# EAGLE design mini_Quad_v00 (EAGLE 9.0.1)
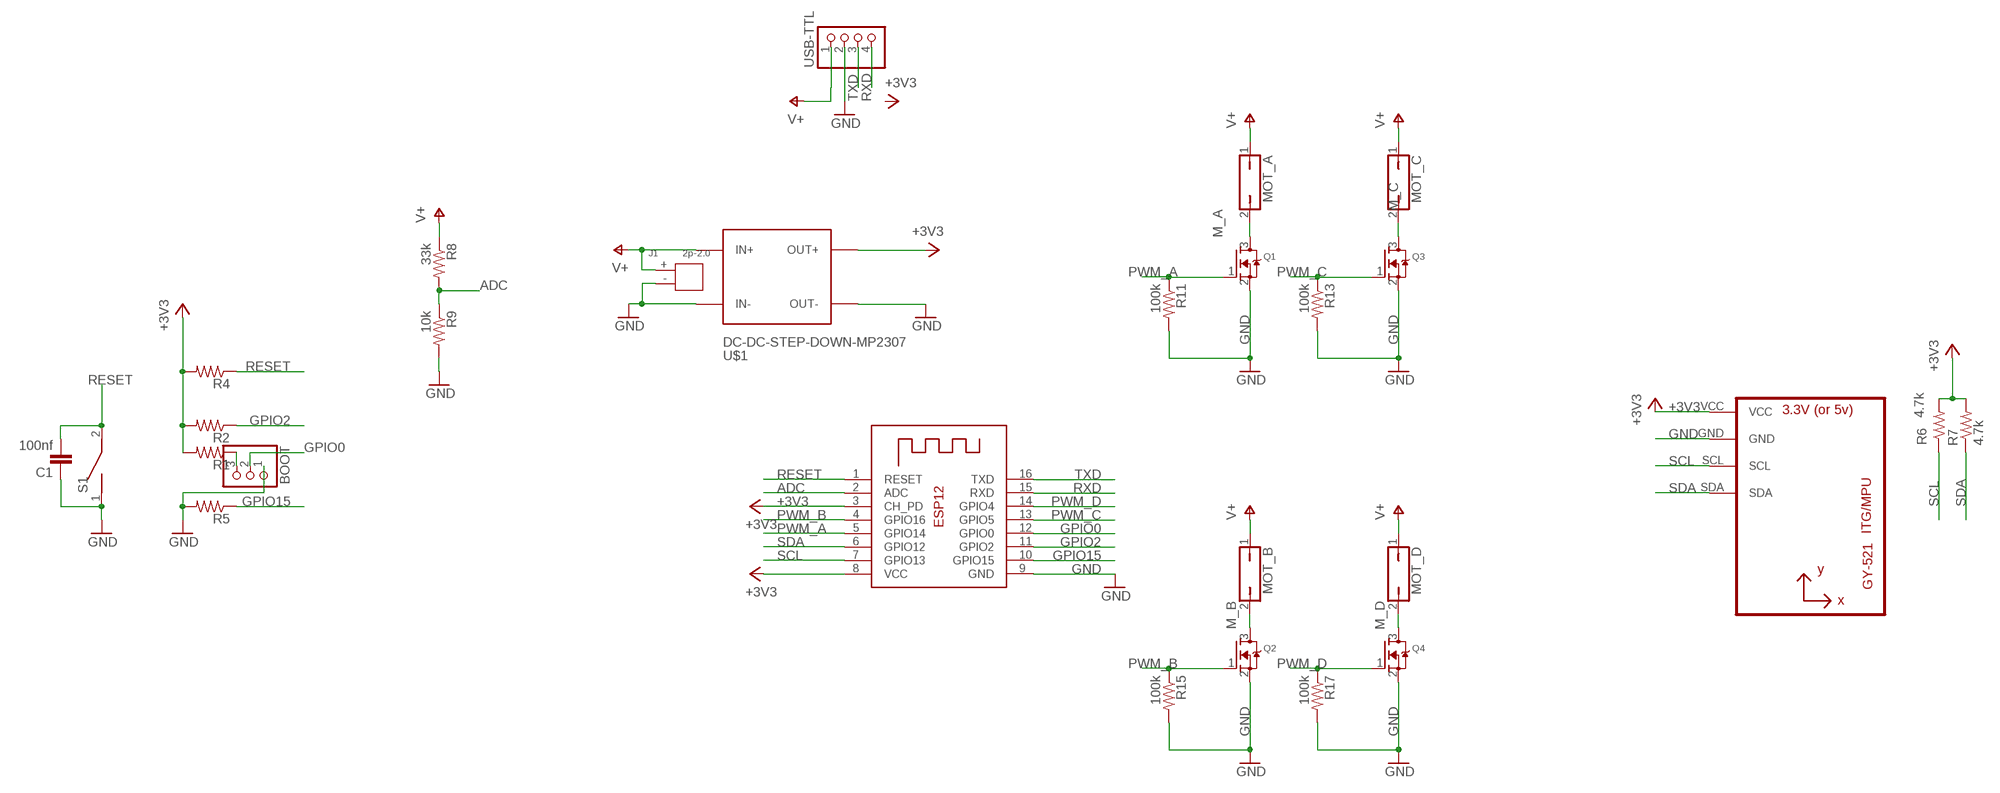
[diagram p0: schematic, sheet 1]

## Parts
BOOT  PINHD-1X3  [1X03]
C1  100nf  C-EU050-024X044  [C050-024X044]
J1  2p-2.0  DIP-JST-2P-2.0  [H2-2.0-6X4.5MM]
MOT_A  JP1Q  [JP1]
MOT_B  JP1Q  [JP1]
MOT_C  JP1Q  [JP1]
MOT_D  JP1Q  [JP1]
Q1  MOSFET-NTO252  [TO252]
Q2  MOSFET-NTO252  [TO252]
Q3  MOSFET-NTO252  [TO252]
Q4  MOSFET-NTO252  [TO252]
R1  R-US_0204/5  [0204/5]
R2  R-US_0204/5  [0204/5]
R4  R-US_0204/7  [0204/7]
R5  R-US_0204/5  [0204/5]
R6  4.7k  R-US_0204/5  [0204/5]
R7  4.7k  R-US_0204/7  [0204/7]
R8  33k  R-US_0207/10  [0207/10]
R9  10k  R-US_0204/7  [0204/7]
R11  100k  R-US_0204/5  [0204/5]
R13  100k  R-US_0204/5  [0204/5]
R15  100k  R-US_0204/5  [0204/5]
R17  100k  R-US_0204/5  [0204/5]
S1  DS01  [DS-01]
U1  GY-521MPU6050  [GY-521]
U$1  DC-DC-STEP-DOWN-MP2307  [DC-DC-STEP-DOWN-MP2307]
USB-TTL  PINHD-1X4  [1X04]
X1  ESP-12  [ESP-12]

## Nets
+3V3: R1.2 R2.2 R4.2 R6.2 R7.2 U1.VCC U$1.OUT+ X1.3(CH_PD) X1.8(VCC)
ADC: R8.2 R9.1 X1.2(ADC)
GND: BOOT.1 C1.1 J1.- Q1.2(S) Q2.2(S) Q3.2(S) Q4.2(S) R5.2 R9.2 R11.2 R13.2 R15.2 R17.2 S1.1 U1.GND U$1.IN- U$1.OUT- USB-TTL.2 X1.9(GND)
GPIO0: BOOT.2 X1.12(GPIO0)
GPIO2: R2.1 X1.11(GPIO2)
GPIO15: R5.1 X1.10(GPIO15)
M_A: MOT_A.2 Q1.3(D)
M_B: MOT_B.2 Q2.3(D)
M_C: MOT_C.2 Q3.3(D)
M_D: MOT_D.2 Q4.3(D)
N$1: BOOT.3 R1.1
PWM_A: Q1.1(G) R11.1 X1.5(GPIO14)
PWM_B: Q2.1(G) R15.1 X1.4(GPIO16)
PWM_C: Q3.1(G) R13.1 X1.13(GPIO5)
PWM_D: Q4.1(G) R17.1 X1.14(GPIO4)
RESET: C1.2 R4.1 S1.2 X1.1(RESET)
RXD: USB-TTL.4 X1.15(RXD)
SCL: R6.1 U1.SCL X1.7(GPIO13)
SDA: R7.1 U1.SDA X1.6(GPIO12)
TXD: USB-TTL.3 X1.16(TXD)
V+: J1.+ MOT_A.1 MOT_B.1 MOT_C.1 MOT_D.1 R8.1 U$1.IN+ USB-TTL.1

## Library data of the parts
BOOT = mini_Quad_v00:PINHD-1X3: PIN HEADER
C1 = mini_Quad_v00:C-EU: CAPACITOR, European symbol; SPICEPREFIX: C
J1 = mini_Quad_v00:DIP-JST-2P-2.0: 320110049
MOT_A MOT_B MOT_C MOT_D = mini_Quad_v00:JP1Q: JUMPER
Q1-Q4 = mini_Quad_v00:MOSFET-N: N-Channel Mosfet 2N7002E - 60V 260mA SOT23 [Digikey: 2N7002ET1GOSTR-ND] - REEL BSH103 - 30V 850mA SOT23 [Digikey: 568-5013-1-ND]
R1 R2 R4-R9 R11 R13 R15 R17 = mini_Quad_v00:R-US_: RESISTOR, American symbol; SPICEPREFIX: R
S1 = mini_Quad_v00:DS01: DIL/CODE SWITCH; OC_FARNELL: unknown; OC_NEWARK: unknown
U1 = mini_Quad_v00:GY-521
U$1 = mini_Quad_v00:DC-DC-STEP-DOWN-MP2307: DC/DC Step-Down Regulator based on MP2307DN chip MP2307 datasheet available here: https://cdn-shop.adafruit.com/datasheets/MP2307_r1.9.pdf Click here to find device on ebay.com <http://www.ebay.com/sch/dc+dc+3a+mini+converter>
USB-TTL = pinhead:PINHD-1X4: PIN HEADER
X1 = mini_Quad_v00:ESP-12

## Board
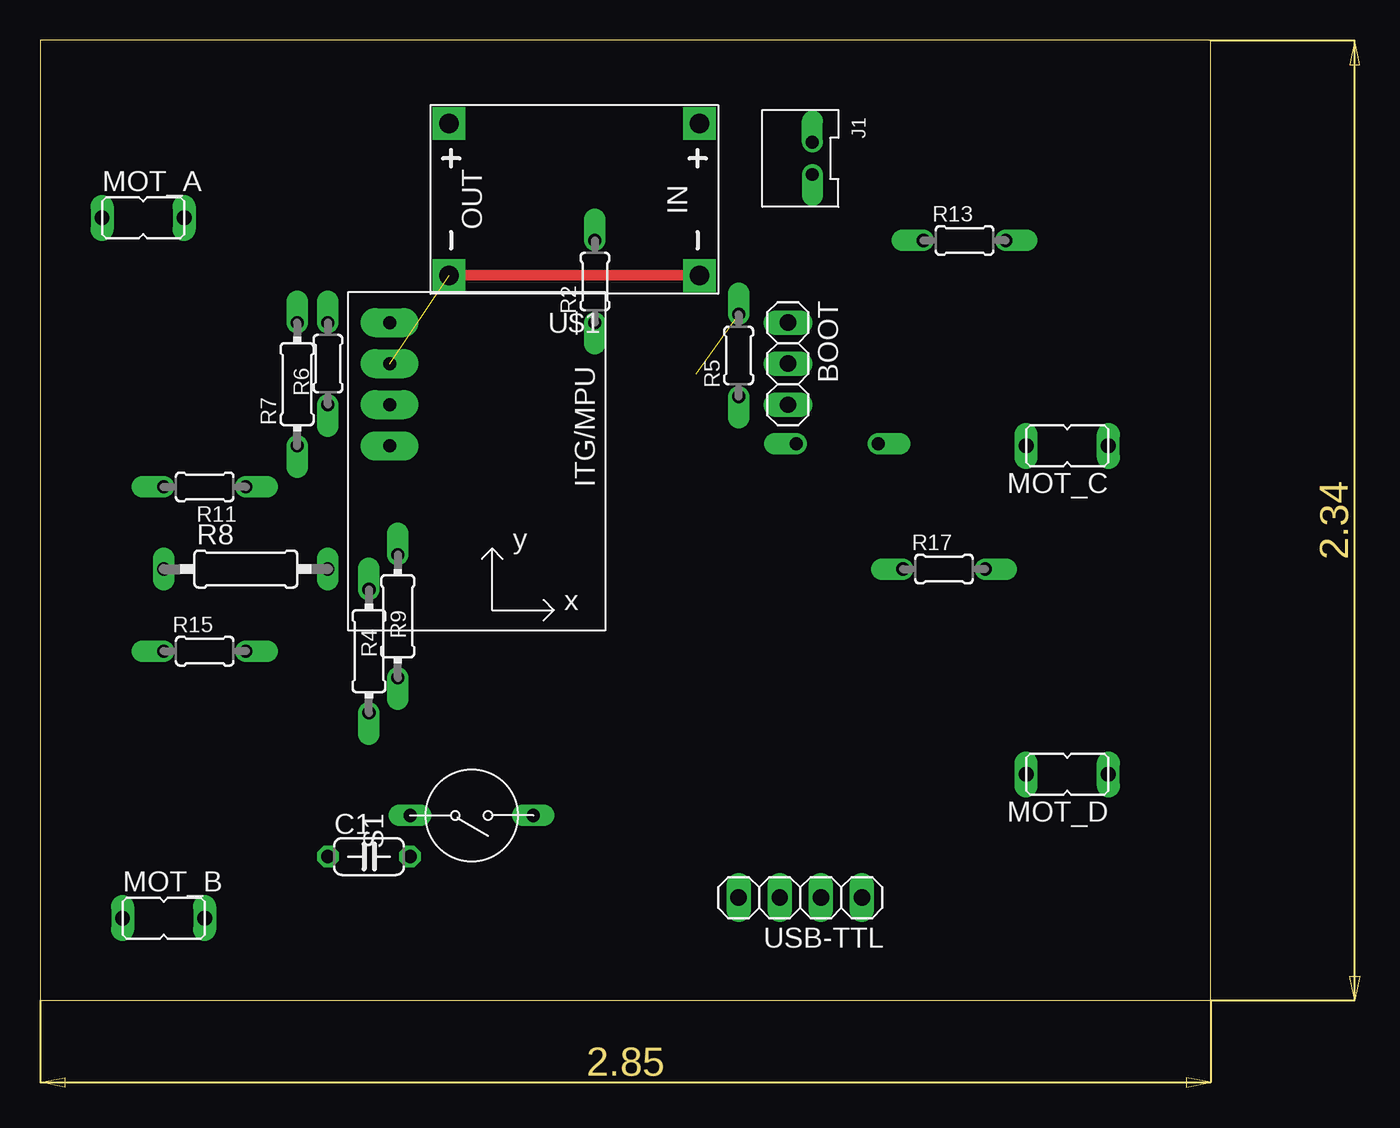
[diagram p1: board, top side]
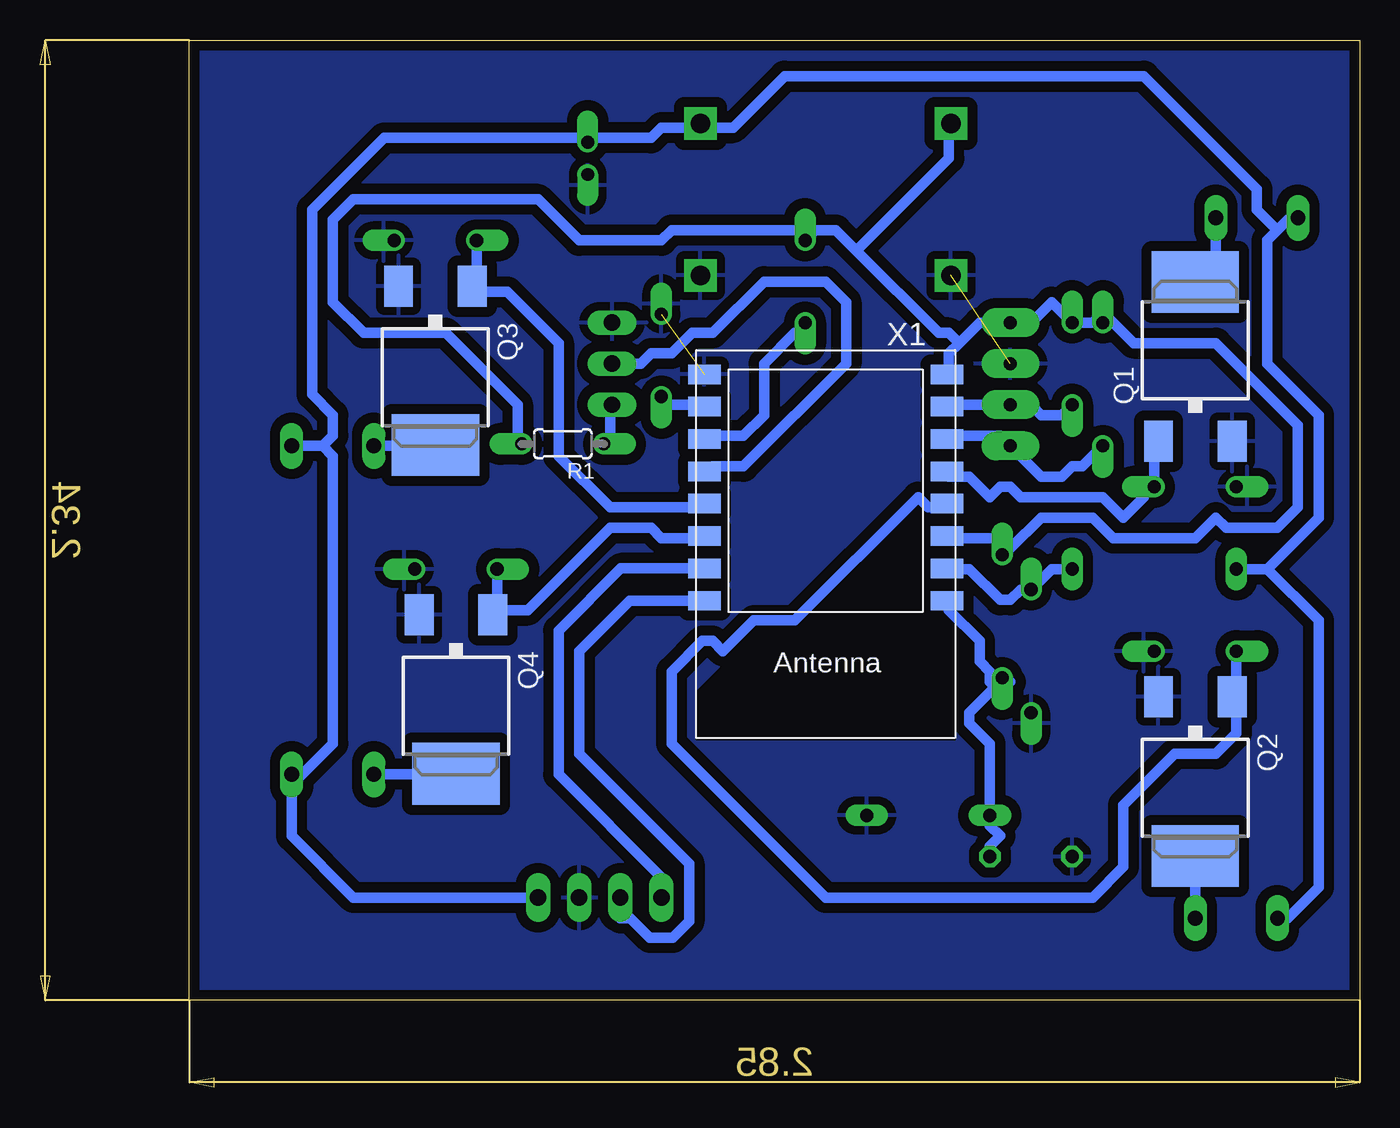
[diagram p2: board, bottom side, seen from below]

Size 72.37 x 59.36 mm. Coordinates in mm from the lower left corner, seen from the top.
Outline: 0,0 72.37,0 72.37,59.36 0,59.36 0,0
Copper layers (1*16): Top 0.035mm / dielectric 1.5mm / Bottom 0.035mm
Design rules "default_25th": minimum track width 25mil, minimum drill 30mil, track to track 25mil, track to pad 25mil, pad to pad 25mil, via to via 25mil, smd to smd 6mil, copper to edge 25mil, drill to drill 30mil, minimum pad ring 10mil, minimum via ring 8mil, stop-mask expansion 4mil, vias tented up to drill 0mil, thermal gap 20mil

### Footprints (pad centres in the part's own frame; a part is rotated, then mirrored left to right if it is on the bottom)
1X03 = drill 1.016 long: 1 -2.54,0; 2 0,0; 3 2.54,0
C050-024X044 = drill 0.813 octagon: 1 -2.54,0; 2 2.54,0
H2-2.0-6X4.5MM = drill 0.8 pad 1.3 offset: + -1,0.75; - 1,0.75
JP1 = drill 0.914 long: 1 0,-2.54; 2 0,2.54
TO252 = smd 1.778 x 2.54: 1 -2.28,-4.8; 2 2.28,-4.8 | smd 5.4 x 3.81: 3 0,5.04
0204/5 = drill 0.813 offset: 1 -2.54,0; 2 2.54,0
0204/7 = drill 0.813 offset: 1 -3.81,0; 2 3.81,0
0207/10 = drill 0.813 long: 1 -5.08,0; 2 5.08,0
DS-01 = drill 0.813 long: 1 0,-3.81; 2 0,3.81
GY-521 = drill 0.8 pad 1.778 long: GND -8.89,6.35; SCL -8.89,3.81; SDA -8.89,1.27; VCC -8.89,8.89
DC-DC-STEP-DOWN-MP2307 = drill 1.2 pad 2 square: IN+ -7.747,-4.699; IN- -7.747,4.699; OUT+ 7.747,-4.699; OUT- 7.747,4.699
1X04 = drill 1.016 long: 1 -3.81,0; 2 -1.27,0; 3 1.27,0; 4 3.81,0
ESP-12 = smd 2 x 1.2: 1 -7.5,4.5; 2 -7.5,2.5; 3 -7.5,0.5; 4 -7.5,-1.5; 5 -7.5,-3.5; 6 -7.5,-5.5; 7 -7.5,-7.5; 8 -7.5,-9.5; 9 7.5,-9.5; 10 7.5,-7.5; 11 7.5,-5.5; 12 7.5,-3.5; 13 7.5,-1.5; 14 7.5,0.5; 15 7.5,2.5; 16 7.5,4.5

### Placement (x,y rotation side)
BOOT  46.23,39.37 270 top
C1  20.32,8.89 0 top
J1  46.99,52.07 270 top
MOT_A  6.35,48.39 270 top
MOT_B  7.62,5.08 270 top
MOT_C  63.5,34.29 90 top
MOT_D  63.5,13.97 90 top
Q1  10.16,39.37 0 bottom
Q2  10.16,13.97 180 bottom
Q3  57.15,39.37 180 bottom
Q4  55.88,19.05 180 bottom
R1  49.28,34.42 180 bottom
R2  34.29,44.45 90 top
R4  22.1,23.75 90 top
R5  43.18,39.88 90 top
R6  17.78,39.37 90 top
R7  15.88,38.1 90 top
R8  12.7,26.67 0 top
R9  20.32,21.59 270 top
R11  10.16,31.75 180 top
R13  57.15,46.99 0 top
R15  10.16,21.59 0 top
R17  55.88,26.67 0 top
S1  26.67,11.43 90 top
U1  30.48,33.02 0 top
U$1  33.02,49.53 180 top
USB-TTL  46.99,6.35 180 top
X1  33.02,29.21 180 bottom

### Tracks (layer width: path | path; a pad name or v marks a point on that pad's centre or on a via)
+3V3
  Bottom 0.635: 21.59,27.94 22.23,28.57 25.4,28.57 X1.3 | 21.59,27.94 R4.2 21.59,27.94 | 16.51,41.91 R6.2 19.05,43.18 20.32,41.91 U1.VCC 23.5,41.91 24.77,40.64 | 16.51,41.91 R7.2 16.51,41.91 | 24.77,40.64 25.4,40.01 25.4,38.73 X1.8 | 33.66,47.62 R2.2 33.66,47.62 | 33.66,47.62 32.38,47.62 31.11,46.35 | 31.11,46.35 26.04,41.27 25.4,41.27 24.77,40.64 | 33.66,47.62 42.55,47.62 43.18,46.99 48.26,46.99 50.8,49.53 62.23,49.53 63.5,48.26 63.5,43.18 61.59,41.27 56.52,41.27 52.07,36.83 52.07,34.92 R1.2 | 21.59,27.94 19.68,29.84 16.51,29.84 15.24,28.57 10.16,28.57 8.89,29.84 8.26,29.21 5.08,29.21 3.81,30.48 3.81,35.56 8.89,40.64 13.97,40.64 15.88,42.55 16.51,41.91 | 31.11,46.35 25.4,52.07 25.4,53.98 U$1.OUT+
ADC
  Bottom 0.635: X1.2 25.4,26.67 24.13,26.67 22.23,24.77 21.59,24.77 20.95,25.4 R9.1 19.05,26.67 R8.2
GND  (2 unrouted)
  Top 0.635: U$1.IN- U$1.OUT-
  pour Bottom: -12.7,73.66 -12.7,-7.62 104.14,-7.62 104.14,73.66
GPIO0
  Bottom 0.635: X1.12 40.01,33.02 38.1,33.02 31.75,39.37 31.75,43.18 33.02,44.45 36.83,44.45 40.01,41.27 41.27,41.27 42.55,40.01 43.81,40.01 44.45,39.37 45.72,39.37 BOOT.2
GPIO2
  Bottom 0.635: R2.1 34.29,41.27 34.92,41.27 36.83,39.37 36.83,36.2 38.1,34.92 40.01,34.92 X1.11
GPIO15
  Bottom 0.635: X1.10 40.64,36.83 43.18,36.83 R5.1
M_A
  Bottom 0.635: MOT_A.2 8.89,48.26 8.89,45.72 10.16,44.45 Q1.3
M_B
  Bottom 0.635: MOT_B.2 10.16,8.89 Q2.3
M_C
  Bottom 0.635: MOT_C.2 57.15,34.29 Q3.3
M_D
  Bottom 0.635: MOT_D.2 55.88,13.97 Q4.3
N$1
  Bottom 0.635: R1.1 46.35,34.92 46.35,36.83 BOOT.3
PWM_A
  Bottom 0.635: X1.5 25.4,32.38 24.13,32.38 22.86,31.11 22.23,31.75 21.59,31.75 20.95,31.11 15.88,31.11 14.61,29.84 13.34,31.11 13.34,31.75 R11.1 12.7,34.29 Q1.1
PWM_B
  Bottom 0.635: X1.4 26.04,30.48 26.67,30.48 27.3,31.11 34.92,23.5 37.47,23.5 39.37,21.59 40.01,22.23 40.64,22.23 42.55,20.32 42.55,15.88 33.02,6.35 16.51,6.35 14.61,8.26 14.61,12.06 11.43,15.24 8.89,15.24 7.62,16.51 7.62,18.41 Q2.1 7.62,19.05 R15.1
PWM_C
  Bottom 0.635: X1.13 40.64,30.48 46.35,30.48 49.53,33.66 49.53,40.64 52.7,43.81 54.61,43.81 Q3.1 54.61,44.45 R13.1
PWM_D
  Bottom 0.635: 53.34,24.13 51.44,24.13 46.35,29.21 43.81,29.21 43.18,28.57 40.64,28.57 X1.14 | 53.34,24.13 Q4.1 53.34,24.13 | 53.34,24.13 R17.1
RESET
  Bottom 0.635: C1.2 22.86,9.53 22.23,10.16 22.86,10.79 S1.2 22.86,15.88 24.13,17.14 24.13,17.78 22.23,19.68 R4.1 21.59,19.68 22.23,19.05 22.86,19.68 22.86,20.32 23.5,20.95 23.5,22.23 25.4,24.13 X1.1
RXD
  Bottom 0.635: X1.15 45.68,26.71 49.53,22.86 49.53,13.97 43.18,7.62 USB-TTL.4
SCL
  Bottom 0.635: X1.7 25.4,36.83 U1.SCL 20.32,36.83 19.68,36.2 18.41,36.2 R6.1
SDA
  Bottom 0.635: X1.6 25.4,34.92 22.23,34.92 U1.SDA 20.95,34.29 20.95,33.66 19.68,32.38 18.41,32.38 17.78,33.02 17.14,33.02 R7.1
TXD
  Bottom 0.635: X1.16 45.14,24.71 48.26,21.59 48.26,15.24 41.47,8.45 41.47,4.88 42.47,3.87 43.89,3.87 45.1,5.08 45.72,5.08 USB-TTL.3
V+
  Bottom 0.635: USB-TTL.1 62.23,6.35 66.04,10.16 66.04,13.34 | 66.04,13.34 MOT_D.1 66.04,13.34 | 5.71,26.67 R8.1 | 5.71,26.67 2.54,23.5 2.54,6.99 4.45,5.08 MOT_B.1 | 5.08,47.62 5.71,46.99 5.71,39.37 2.54,36.2 2.54,29.84 5.71,26.67 | 5.08,47.62 4.45,48.26 3.81,48.26 MOT_A.1 | 64.14,34.29 MOT_C.1 | 64.14,34.29 63.5,33.66 63.5,15.88 66.04,13.34 | 64.14,34.29 63.5,34.92 63.5,36.2 64.77,37.47 64.77,48.9 60.33,53.34 48.26,53.34 J1.+ 47.62,53.34 43.81,53.34 43.18,53.98 41.27,53.98 U$1.IN+ 40.64,53.98 38.73,53.98 35.56,57.15 13.34,57.15 6.35,50.16 6.35,48.9 5.08,47.62